# EAGLE design PGTNX06_ioexpander (EAGLE 9.6.0)
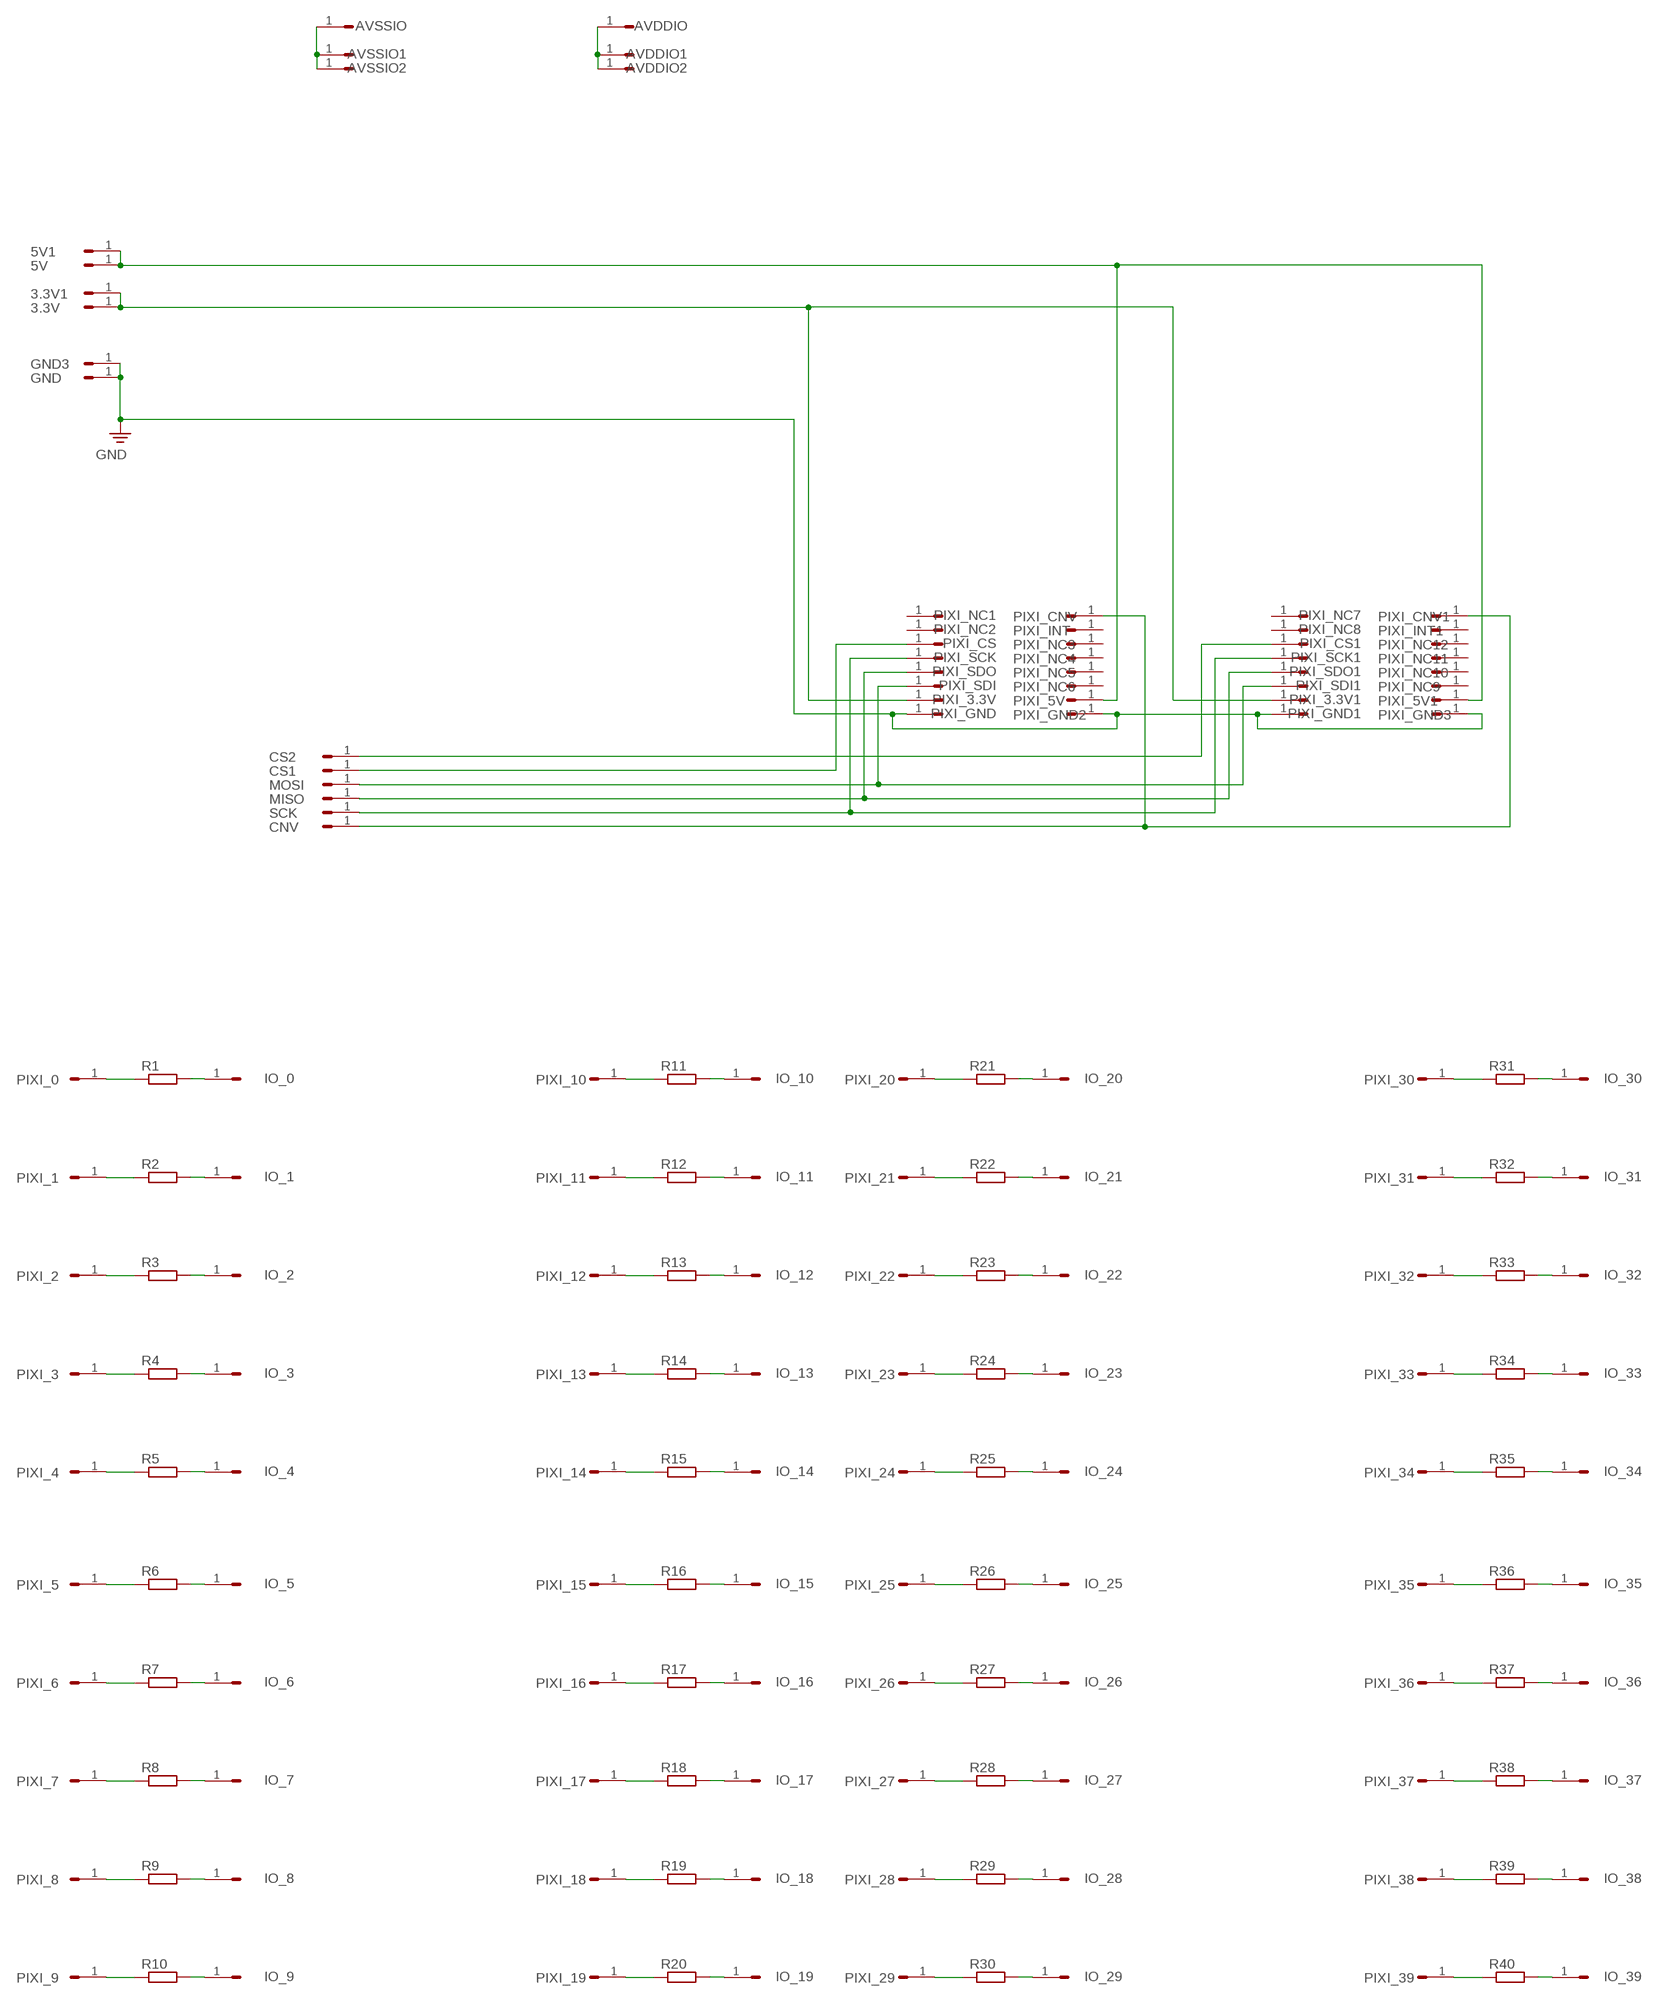
[diagram p0: schematic, sheet 1]

## Parts
3.3V  HEADER/MALE/01  [HEADER/MALE/01]
3.3V1  HEADER/MALE/01  [HEADER/MALE/01]
5V  HEADER/MALE/01  [HEADER/MALE/01]
5V1  HEADER/MALE/01  [HEADER/MALE/01]
AVDDIO  HEADER/MALE/01  [HEADER/MALE/01]
AVDDIO1  HEADER/MALE/01  [HEADER/MALE/01]
AVDDIO2  HEADER/MALE/01  [HEADER/MALE/01]
AVSSIO  HEADER/MALE/01  [HEADER/MALE/01]
AVSSIO1  HEADER/MALE/01  [HEADER/MALE/01]
AVSSIO2  HEADER/MALE/01  [HEADER/MALE/01]
CNV  HEADER/MALE/01  [HEADER/MALE/01]
CS1  HEADER/MALE/01  [HEADER/MALE/01]
CS2  HEADER/MALE/01  [HEADER/MALE/01]
GND  HEADER/MALE/01  [HEADER/MALE/01]
GND3  HEADER/MALE/01  [HEADER/MALE/01]
IO_0  HEADER/MALE/01  [HEADER/MALE/01]
IO_1  HEADER/MALE/01  [HEADER/MALE/01]
IO_2  HEADER/MALE/01  [HEADER/MALE/01]
IO_3  HEADER/MALE/01  [HEADER/MALE/01]
IO_4  HEADER/MALE/01  [HEADER/MALE/01]
IO_5  HEADER/MALE/01  [HEADER/MALE/01]
IO_6  HEADER/MALE/01  [HEADER/MALE/01]
IO_7  HEADER/MALE/01  [HEADER/MALE/01]
IO_8  HEADER/MALE/01  [HEADER/MALE/01]
IO_9  HEADER/MALE/01  [HEADER/MALE/01]
IO_10  HEADER/MALE/01  [HEADER/MALE/01]
IO_11  HEADER/MALE/01  [HEADER/MALE/01]
IO_12  HEADER/MALE/01  [HEADER/MALE/01]
IO_13  HEADER/MALE/01  [HEADER/MALE/01]
IO_14  HEADER/MALE/01  [HEADER/MALE/01]
IO_15  HEADER/MALE/01  [HEADER/MALE/01]
IO_16  HEADER/MALE/01  [HEADER/MALE/01]
IO_17  HEADER/MALE/01  [HEADER/MALE/01]
IO_18  HEADER/MALE/01  [HEADER/MALE/01]
IO_19  HEADER/MALE/01  [HEADER/MALE/01]
IO_20  HEADER/MALE/01  [HEADER/MALE/01]
IO_21  HEADER/MALE/01  [HEADER/MALE/01]
IO_22  HEADER/MALE/01  [HEADER/MALE/01]
IO_23  HEADER/MALE/01  [HEADER/MALE/01]
IO_24  HEADER/MALE/01  [HEADER/MALE/01]
IO_25  HEADER/MALE/01  [HEADER/MALE/01]
IO_26  HEADER/MALE/01  [HEADER/MALE/01]
IO_27  HEADER/MALE/01  [HEADER/MALE/01]
IO_28  HEADER/MALE/01  [HEADER/MALE/01]
IO_29  HEADER/MALE/01  [HEADER/MALE/01]
IO_30  HEADER/MALE/01  [HEADER/MALE/01]
IO_31  HEADER/MALE/01  [HEADER/MALE/01]
IO_32  HEADER/MALE/01  [HEADER/MALE/01]
IO_33  HEADER/MALE/01  [HEADER/MALE/01]
IO_34  HEADER/MALE/01  [HEADER/MALE/01]
IO_35  HEADER/MALE/01  [HEADER/MALE/01]
IO_36  HEADER/MALE/01  [HEADER/MALE/01]
IO_37  HEADER/MALE/01  [HEADER/MALE/01]
IO_38  HEADER/MALE/01  [HEADER/MALE/01]
IO_39  HEADER/MALE/01  [HEADER/MALE/01]
MISO  HEADER/MALE/01  [HEADER/MALE/01]
MOSI  HEADER/MALE/01  [HEADER/MALE/01]
PIXI_0  HEADER/MALE/01  [HEADER/MALE/01]
PIXI_1  HEADER/MALE/01  [HEADER/MALE/01]
PIXI_2  HEADER/MALE/01  [HEADER/MALE/01]
PIXI_3  HEADER/MALE/01  [HEADER/MALE/01]
PIXI_3.3V  HEADER/MALE/01  [HEADER/MALE/01]
PIXI_3.3V1  HEADER/MALE/01  [HEADER/MALE/01]
PIXI_4  HEADER/MALE/01  [HEADER/MALE/01]
PIXI_5  HEADER/MALE/01  [HEADER/MALE/01]
PIXI_5V  HEADER/MALE/01  [HEADER/MALE/01]
PIXI_5V1  HEADER/MALE/01  [HEADER/MALE/01]
PIXI_6  HEADER/MALE/01  [HEADER/MALE/01]
PIXI_7  HEADER/MALE/01  [HEADER/MALE/01]
PIXI_8  HEADER/MALE/01  [HEADER/MALE/01]
PIXI_9  HEADER/MALE/01  [HEADER/MALE/01]
PIXI_10  HEADER/MALE/01  [HEADER/MALE/01]
PIXI_11  HEADER/MALE/01  [HEADER/MALE/01]
PIXI_12  HEADER/MALE/01  [HEADER/MALE/01]
PIXI_13  HEADER/MALE/01  [HEADER/MALE/01]
PIXI_14  HEADER/MALE/01  [HEADER/MALE/01]
PIXI_15  HEADER/MALE/01  [HEADER/MALE/01]
PIXI_16  HEADER/MALE/01  [HEADER/MALE/01]
PIXI_17  HEADER/MALE/01  [HEADER/MALE/01]
PIXI_18  HEADER/MALE/01  [HEADER/MALE/01]
PIXI_19  HEADER/MALE/01  [HEADER/MALE/01]
PIXI_20  HEADER/MALE/01  [HEADER/MALE/01]
PIXI_21  HEADER/MALE/01  [HEADER/MALE/01]
PIXI_22  HEADER/MALE/01  [HEADER/MALE/01]
PIXI_23  HEADER/MALE/01  [HEADER/MALE/01]
PIXI_24  HEADER/MALE/01  [HEADER/MALE/01]
PIXI_25  HEADER/MALE/01  [HEADER/MALE/01]
PIXI_26  HEADER/MALE/01  [HEADER/MALE/01]
PIXI_27  HEADER/MALE/01  [HEADER/MALE/01]
PIXI_28  HEADER/MALE/01  [HEADER/MALE/01]
PIXI_29  HEADER/MALE/01  [HEADER/MALE/01]
PIXI_30  HEADER/MALE/01  [HEADER/MALE/01]
PIXI_31  HEADER/MALE/01  [HEADER/MALE/01]
PIXI_32  HEADER/MALE/01  [HEADER/MALE/01]
PIXI_33  HEADER/MALE/01  [HEADER/MALE/01]
PIXI_34  HEADER/MALE/01  [HEADER/MALE/01]
PIXI_35  HEADER/MALE/01  [HEADER/MALE/01]
PIXI_36  HEADER/MALE/01  [HEADER/MALE/01]
PIXI_37  HEADER/MALE/01  [HEADER/MALE/01]
PIXI_38  HEADER/MALE/01  [HEADER/MALE/01]
PIXI_39  HEADER/MALE/01  [HEADER/MALE/01]
PIXI_CNV  HEADER/MALE/01  [HEADER/MALE/01]
PIXI_CNV1  HEADER/MALE/01  [HEADER/MALE/01]
PIXI_CS  HEADER/MALE/01  [HEADER/MALE/01]
PIXI_CS1  HEADER/MALE/01  [HEADER/MALE/01]
PIXI_GND  HEADER/MALE/01  [HEADER/MALE/01]
PIXI_GND1  HEADER/MALE/01  [HEADER/MALE/01]
PIXI_GND2  HEADER/MALE/01  [HEADER/MALE/01]
PIXI_GND3  HEADER/MALE/01  [HEADER/MALE/01]
PIXI_INT  HEADER/MALE/01  [HEADER/MALE/01]
PIXI_INT1  HEADER/MALE/01  [HEADER/MALE/01]
PIXI_NC1  HEADER/MALE/01  [HEADER/MALE/01]
PIXI_NC2  HEADER/MALE/01  [HEADER/MALE/01]
PIXI_NC3  HEADER/MALE/01  [HEADER/MALE/01]
PIXI_NC4  HEADER/MALE/01  [HEADER/MALE/01]
PIXI_NC5  HEADER/MALE/01  [HEADER/MALE/01]
PIXI_NC6  HEADER/MALE/01  [HEADER/MALE/01]
PIXI_NC7  HEADER/MALE/01  [HEADER/MALE/01]
PIXI_NC8  HEADER/MALE/01  [HEADER/MALE/01]
PIXI_NC9  HEADER/MALE/01  [HEADER/MALE/01]
PIXI_NC10  HEADER/MALE/01  [HEADER/MALE/01]
PIXI_NC11  HEADER/MALE/01  [HEADER/MALE/01]
PIXI_NC12  HEADER/MALE/01  [HEADER/MALE/01]
PIXI_SCK  HEADER/MALE/01  [HEADER/MALE/01]
PIXI_SCK1  HEADER/MALE/01  [HEADER/MALE/01]
PIXI_SDI  HEADER/MALE/01  [HEADER/MALE/01]
PIXI_SDI1  HEADER/MALE/01  [HEADER/MALE/01]
PIXI_SDO  HEADER/MALE/01  [HEADER/MALE/01]
PIXI_SDO1  HEADER/MALE/01  [HEADER/MALE/01]
R1  RESISTORRESISTOR/UPRIGHT/7.5  [RESISTOR/7.5]
R2  RESISTORRESISTOR/UPRIGHT/7.5  [RESISTOR/7.5]
R3  RESISTORRESISTOR/UPRIGHT/7.5  [RESISTOR/7.5]
R4  RESISTORRESISTOR/UPRIGHT/7.5  [RESISTOR/7.5]
R5  RESISTORRESISTOR/UPRIGHT/7.5  [RESISTOR/7.5]
R6  RESISTORRESISTOR/UPRIGHT/7.5  [RESISTOR/7.5]
R7  RESISTORRESISTOR/UPRIGHT/7.5  [RESISTOR/7.5]
R8  RESISTORRESISTOR/UPRIGHT/7.5  [RESISTOR/7.5]
R9  RESISTORRESISTOR/UPRIGHT/7.5  [RESISTOR/7.5]
R10  RESISTORRESISTOR/UPRIGHT/7.5  [RESISTOR/7.5]
R11  RESISTORRESISTOR/UPRIGHT/7.5  [RESISTOR/7.5]
R12  RESISTORRESISTOR/UPRIGHT/7.5  [RESISTOR/7.5]
R13  RESISTORRESISTOR/UPRIGHT/7.5  [RESISTOR/7.5]
R14  RESISTORRESISTOR/UPRIGHT/7.5  [RESISTOR/7.5]
R15  RESISTORRESISTOR/UPRIGHT/7.5  [RESISTOR/7.5]
R16  RESISTORRESISTOR/UPRIGHT/7.5  [RESISTOR/7.5]
R17  RESISTORRESISTOR/UPRIGHT/7.5  [RESISTOR/7.5]
R18  RESISTORRESISTOR/UPRIGHT/7.5  [RESISTOR/7.5]
R19  RESISTORRESISTOR/UPRIGHT/7.5  [RESISTOR/7.5]
R20  RESISTORRESISTOR/UPRIGHT/7.5  [RESISTOR/7.5]
R21  RESISTORRESISTOR/UPRIGHT/7.5  [RESISTOR/7.5]
R22  RESISTORRESISTOR/UPRIGHT/7.5  [RESISTOR/7.5]
R23  RESISTORRESISTOR/UPRIGHT/7.5  [RESISTOR/7.5]
R24  RESISTORRESISTOR/UPRIGHT/7.5  [RESISTOR/7.5]
R25  RESISTORRESISTOR/UPRIGHT/7.5  [RESISTOR/7.5]
R26  RESISTORRESISTOR/UPRIGHT/7.5  [RESISTOR/7.5]
R27  RESISTORRESISTOR/UPRIGHT/7.5  [RESISTOR/7.5]
R28  RESISTORRESISTOR/UPRIGHT/7.5  [RESISTOR/7.5]
R29  RESISTORRESISTOR/UPRIGHT/7.5  [RESISTOR/7.5]
R30  RESISTORRESISTOR/UPRIGHT/7.5  [RESISTOR/7.5]
R31  RESISTORRESISTOR/UPRIGHT/7.5  [RESISTOR/7.5]
R32  RESISTORRESISTOR/UPRIGHT/7.5  [RESISTOR/7.5]
R33  RESISTORRESISTOR/UPRIGHT/7.5  [RESISTOR/7.5]
R34  RESISTORRESISTOR/UPRIGHT/7.5  [RESISTOR/7.5]
R35  RESISTORRESISTOR/UPRIGHT/7.5  [RESISTOR/7.5]
R36  RESISTORRESISTOR/UPRIGHT/7.5  [RESISTOR/7.5]
R37  RESISTORRESISTOR/UPRIGHT/7.5  [RESISTOR/7.5]
R38  RESISTORRESISTOR/UPRIGHT/7.5  [RESISTOR/7.5]
R39  RESISTORRESISTOR/UPRIGHT/7.5  [RESISTOR/7.5]
R40  RESISTORRESISTOR/UPRIGHT/7.5  [RESISTOR/7.5]
SCK  HEADER/MALE/01  [HEADER/MALE/01]

## Nets
3.3V1: 3.3V1.1 3.3V.1 PIXI_3.3V1.1 PIXI_3.3V.1
5V: 5V1.1 5V.1 PIXI_5V1.1 PIXI_5V.1
GND: GND3.1 GND.1 PIXI_GND1.1 PIXI_GND2.1 PIXI_GND3.1 PIXI_GND.1
N$1: PIXI_20.1 R21.1
N$2: CS2.1 PIXI_CS1.1
N$3: IO_20.1 R21.2
N$4: PIXI_21.1 R22.1
N$5: IO_21.1 R22.2
N$6: MISO.1 PIXI_SDO1.1 PIXI_SDO.1
N$7: PIXI_22.1 R23.1
N$8: CS1.1 PIXI_CS.1
N$9: IO_22.1 R23.2
N$10: PIXI_23.1 R24.1
N$11: IO_23.1 R24.2
N$12: PIXI_24.1 R25.1
N$13: IO_24.1 R25.2
N$14: PIXI_25.1 R26.1
N$15: IO_25.1 R26.2
N$16: PIXI_26.1 R27.1
N$17: IO_26.1 R27.2
N$18: PIXI_27.1 R28.1
N$19: IO_27.1 R28.2
N$20: PIXI_28.1 R29.1
N$21: IO_28.1 R29.2
N$22: PIXI_29.1 R30.1
N$23: PIXI_0.1 R1.1
N$24: IO_0.1 R1.2
N$25: PIXI_1.1 R2.1
N$26: IO_29.1 R30.2
N$27: IO_1.1 R2.2
N$28: CNV.1 PIXI_CNV1.1 PIXI_CNV.1
N$29: MOSI.1 PIXI_SDI1.1 PIXI_SDI.1
N$30: PIXI_2.1 R3.1
N$31: PIXI_SCK1.1 PIXI_SCK.1 SCK.1
N$32: PIXI_30.1 R31.1
N$33: IO_2.1 R3.2
N$34: PIXI_3.1 R4.1
N$35: IO_3.1 R4.2
N$36: PIXI_4.1 R5.1
N$37: IO_4.1 R5.2
N$38: PIXI_5.1 R6.1
N$39: IO_5.1 R6.2
N$40: PIXI_6.1 R7.1
N$41: IO_6.1 R7.2
N$42: PIXI_7.1 R8.1
N$43: IO_7.1 R8.2
N$44: PIXI_8.1 R9.1
N$45: IO_8.1 R9.2
N$46: PIXI_9.1 R10.1
N$47: IO_9.1 R10.2
N$48: PIXI_10.1 R11.1
N$49: IO_10.1 R11.2
N$50: PIXI_11.1 R12.1
N$51: IO_11.1 R12.2
N$52: PIXI_12.1 R13.1
N$53: IO_12.1 R13.2
N$54: PIXI_13.1 R14.1
N$55: IO_13.1 R14.2
N$56: PIXI_14.1 R15.1
N$57: IO_14.1 R15.2
N$58: PIXI_15.1 R16.1
N$59: IO_15.1 R16.2
N$60: PIXI_16.1 R17.1
N$61: IO_16.1 R17.2
N$62: PIXI_17.1 R18.1
N$63: IO_17.1 R18.2
N$64: PIXI_18.1 R19.1
N$65: IO_18.1 R19.2
N$66: AVDDIO1.1 AVDDIO2.1 AVDDIO.1
N$67: AVSSIO1.1 AVSSIO2.1 AVSSIO.1
N$68: PIXI_19.1 R20.1
N$69: IO_19.1 R20.2
N$70: IO_30.1 R31.2
N$71: PIXI_31.1 R32.1
N$72: IO_31.1 R32.2
N$73: PIXI_32.1 R33.1
N$74: IO_32.1 R33.2
N$75: PIXI_33.1 R34.1
N$76: IO_33.1 R34.2
N$77: PIXI_34.1 R35.1
N$78: IO_34.1 R35.2
N$79: PIXI_35.1 R36.1
N$80: IO_35.1 R36.2
N$81: PIXI_36.1 R37.1
N$82: IO_36.1 R37.2
N$83: PIXI_37.1 R38.1
N$84: IO_37.1 R38.2
N$85: PIXI_38.1 R39.1
N$86: IO_38.1 R39.2
N$87: PIXI_39.1 R40.1
N$88: IO_39.1 R40.2
Unconnected: PIXI_INT1.1 PIXI_INT.1 PIXI_NC1.1 PIXI_NC2.1 PIXI_NC3.1 PIXI_NC4.1 PIXI_NC5.1 PIXI_NC6.1 PIXI_NC7.1 PIXI_NC8.1 PIXI_NC9.1 PIXI_NC10.1 PIXI_NC11.1 PIXI_NC12.1

## Library data of the parts
3.3V 3.3V1 5V 5V1 AVDDIO AVDDIO1 AVDDIO2 AVSSIO AVSSIO1 AVSSIO2 CNV CS1 CS2 GND GND3 IO_0 IO_1-IO_39 MISO MOSI PIXI_0 PIXI_1-PIXI_3 PIXI_3.3V PIXI_3.3V1 PIXI_4 PIXI_5 PIXI_5V PIXI_5V1 PIXI_6-PIXI_39 PIXI_CNV PIXI_CNV1 PIXI_CS PIXI_CS1 PIXI_GND PIXI_GND1-PIXI_GND3 PIXI_INT PIXI_INT1 PIXI_NC1-PIXI_NC12 PIXI_SCK PIXI_SCK1 PIXI_SDI PIXI_SDI1 PIXI_SDO PIXI_SDO1 SCK = connectors:HEADER/MALE/01; SPICEPREFIX: X
R1-R40 = resistors:RESISTOR: RESISTOR, European symbol

## Board
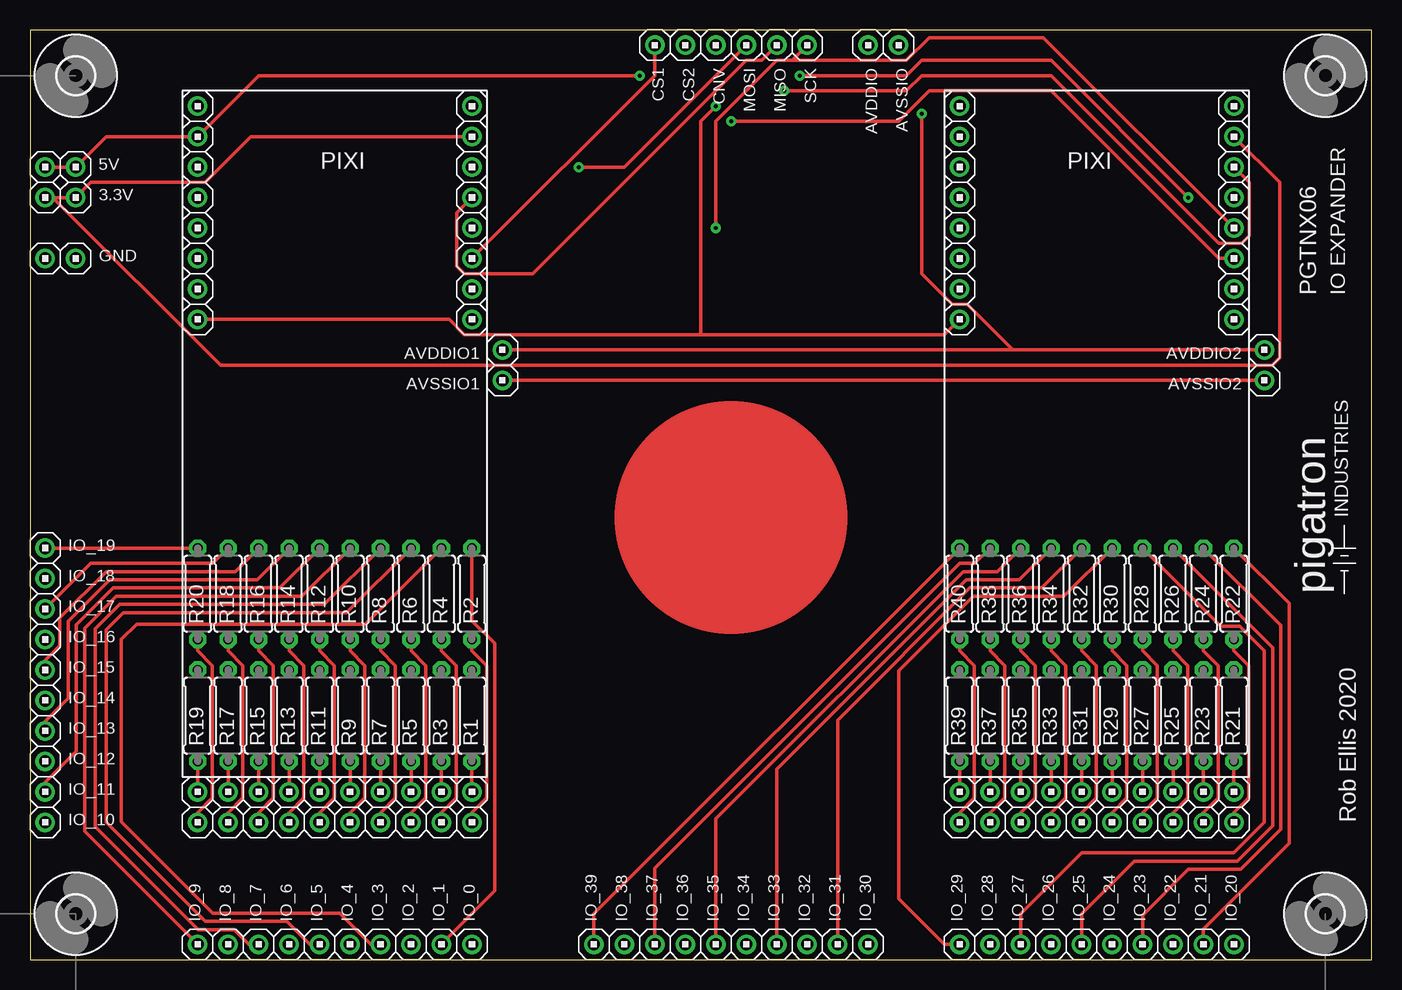
[diagram p1: board, top side]
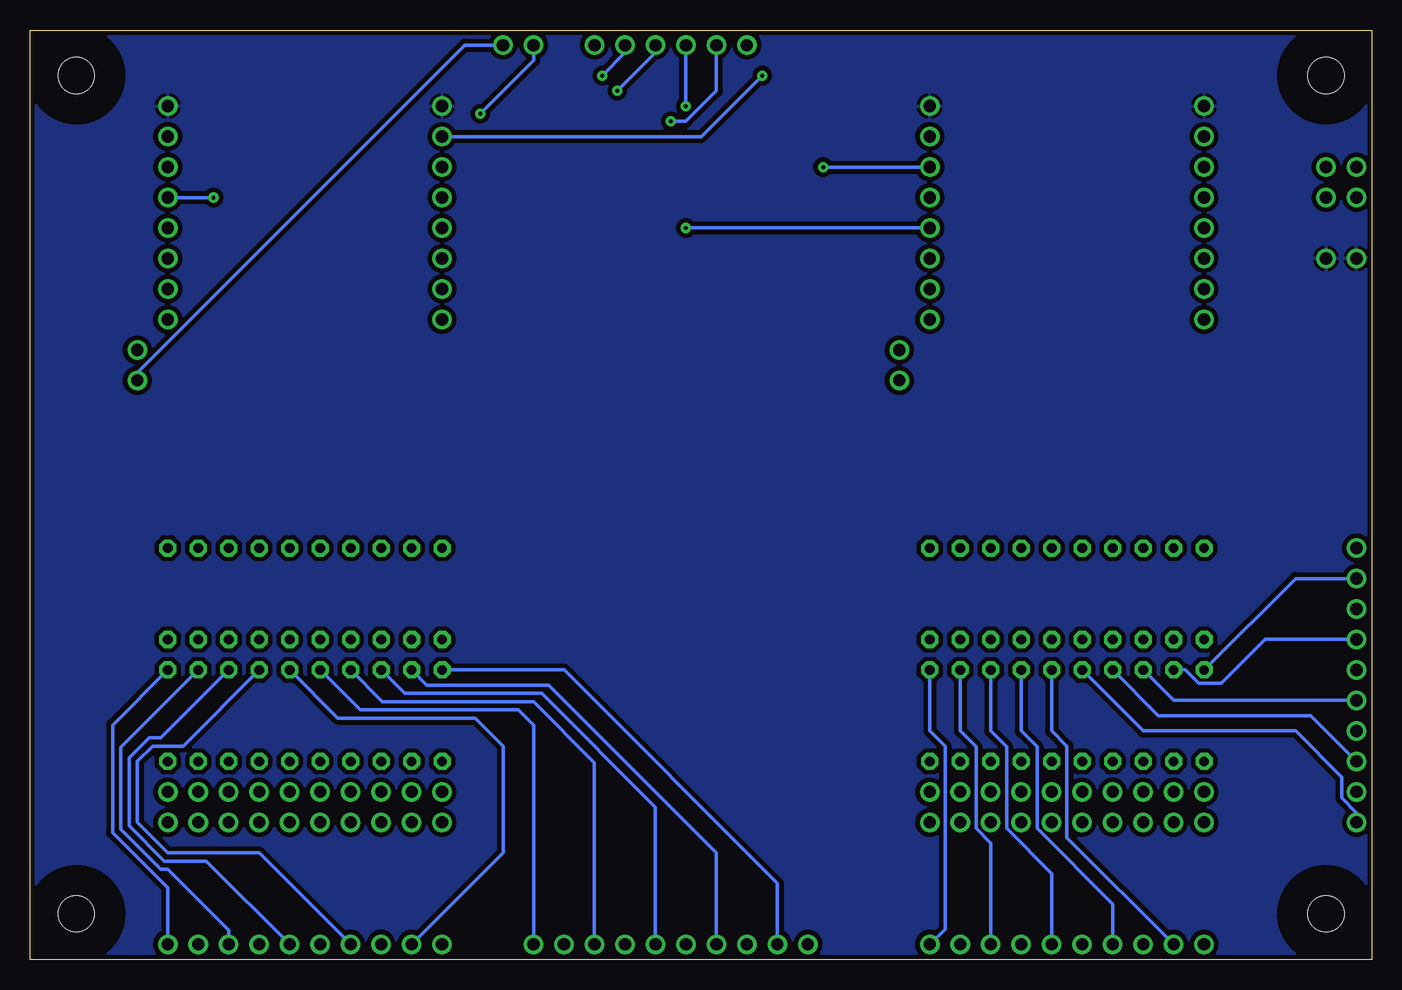
[diagram p2: board, bottom side, seen from below]

Size 111.81 x 77.46 mm. Coordinates in mm from the lower left corner, seen from the top.
Outline: 0,0 111.81,0 111.81,77.46 0,77.46 0,0
Copper layers (1*16): Top 0.0356mm / dielectric 1.5011mm / Bottom 0.0356mm
Design rules "pigatron": minimum track width 12mil, minimum drill 13mil, track to track 15mil, track to pad 10mil, pad to pad 10mil, via to via 10mil, smd to smd 6mil, copper to edge 15mil, drill to drill 10mil, minimum pad ring 12mil, minimum via ring 10mil, stop-mask expansion 4mil, vias tented up to drill 0mil, thermal gap 10mil

### Footprints (pad centres in the part's own frame; a part is rotated, then mirrored left to right if it is on the bottom)
HEADER/MALE/01 = drill 1.016: 1 0,0
RESISTOR/7.5 = drill 0.813 octagon: 1 -3.81,0; 2 3.81,0
STANDOFF/3.0 = hole 3: 0,0

### Placement (x,y rotation side)
3.3V  3.81,63.5 0 top
3.3V1  1.27,63.5 0 top
5V  3.81,66.04 0 top
5V1  1.27,66.04 0 top
AVDDIO  69.85,76.2 270 top
AVDDIO1  39.37,50.8 180 top
AVDDIO2  102.87,50.8 180 top
AVSSIO  72.39,76.2 270 top
AVSSIO1  39.37,48.26 180 top
AVSSIO2  102.87,48.26 180 top
CNV  57.15,76.2 270 top
CS1  52.07,76.2 270 top
CS2  54.61,76.2 270 top
GND  3.81,58.42 0 top
GND3  1.27,58.42 0 top
IO_0  36.83,1.27 90 top
IO_1  34.29,1.27 90 top
IO_2  31.75,1.27 90 top
IO_3  29.21,1.27 90 top
IO_4  26.67,1.27 90 top
IO_5  24.13,1.27 90 top
IO_6  21.59,1.27 90 top
IO_7  19.05,1.27 90 top
IO_8  16.51,1.27 90 top
IO_9  13.97,1.27 90 top
IO_10  1.27,11.43 0 top
IO_11  1.27,13.97 0 top
IO_12  1.27,16.51 0 top
IO_13  1.27,19.05 0 top
IO_14  1.27,21.59 0 top
IO_15  1.27,24.13 0 top
IO_16  1.27,26.67 0 top
IO_17  1.27,29.21 0 top
IO_18  1.27,31.75 0 top
IO_19  1.27,34.29 0 top
IO_20  100.33,1.27 90 top
IO_21  97.79,1.27 90 top
IO_22  95.25,1.27 90 top
IO_23  92.71,1.27 90 top
IO_24  90.17,1.27 90 top
IO_25  87.63,1.27 90 top
IO_26  85.09,1.27 90 top
IO_27  82.55,1.27 90 top
IO_28  80.01,1.27 90 top
IO_29  77.47,1.27 90 top
IO_30  69.85,1.27 90 top
IO_31  67.31,1.27 90 top
IO_32  64.77,1.27 90 top
IO_33  62.23,1.27 90 top
IO_34  59.69,1.27 90 top
IO_35  57.15,1.27 90 top
IO_36  54.61,1.27 90 top
IO_37  52.07,1.27 90 top
IO_38  49.53,1.27 90 top
IO_39  46.99,1.27 90 top
MISO  62.23,76.2 270 top
MOSI  59.69,76.2 270 top
PIXI_0  36.83,13.97 90 top
PIXI_1  36.83,11.43 270 top
PIXI_2  34.29,13.97 90 top
PIXI_3  34.29,11.43 270 top
PIXI_3.3V  36.83,68.58 180 top
PIXI_3.3V1  100.33,68.58 0 top
PIXI_4  31.75,13.97 90 top
PIXI_5  31.75,11.43 270 top
PIXI_5V  13.97,68.58 0 top
PIXI_5V1  77.47,68.58 0 top
PIXI_6  29.21,13.97 90 top
PIXI_7  29.21,11.43 270 top
PIXI_8  26.67,13.97 90 top
PIXI_9  26.67,11.43 270 top
PIXI_10  24.13,13.97 90 top
PIXI_11  24.13,11.43 270 top
PIXI_12  21.59,13.97 90 top
PIXI_13  21.59,11.43 270 top
PIXI_14  19.05,13.97 90 top
PIXI_15  19.05,11.43 270 top
PIXI_16  16.51,13.97 90 top
PIXI_17  16.51,11.43 270 top
PIXI_18  13.97,13.97 90 top
PIXI_19  13.97,11.43 270 top
PIXI_20  100.33,13.97 0 top
PIXI_21  100.33,11.43 0 top
PIXI_22  97.79,13.97 0 top
PIXI_23  97.79,11.43 0 top
PIXI_24  95.25,13.97 0 top
PIXI_25  95.25,11.43 0 top
PIXI_26  92.71,13.97 0 top
PIXI_27  92.71,11.43 0 top
PIXI_28  90.17,13.97 0 top
PIXI_29  90.17,11.43 0 top
PIXI_30  87.63,13.97 0 top
PIXI_31  87.63,11.43 0 top
PIXI_32  85.09,13.97 0 top
PIXI_33  85.09,11.43 0 top
PIXI_34  82.55,13.97 0 top
PIXI_35  82.55,11.43 0 top
PIXI_36  80.01,13.97 0 top
PIXI_37  80.01,11.43 0 top
PIXI_38  77.47,13.97 0 top
PIXI_39  77.47,11.43 0 top
PIXI_CNV  13.97,53.34 0 top
PIXI_CNV1  77.47,53.34 0 top
PIXI_CS  36.83,58.42 180 top
PIXI_CS1  100.33,58.42 0 top
PIXI_GND  36.83,71.12 180 top
PIXI_GND1  77.47,71.12 0 top
PIXI_GND2  13.97,71.12 0 top
PIXI_GND3  100.33,71.12 0 top
PIXI_INT  13.97,55.88 0 top
PIXI_INT1  77.47,55.88 0 top
PIXI_NC1  36.83,53.34 180 top
PIXI_NC2  36.83,55.88 180 top
PIXI_NC3  13.97,58.42 0 top
PIXI_NC4  13.97,60.96 0 top
PIXI_NC5  13.97,63.5 0 top
PIXI_NC6  13.97,66.04 0 top
PIXI_NC7  77.47,66.04 0 top
PIXI_NC8  77.47,63.5 0 top
PIXI_NC9  100.33,53.34 0 top
PIXI_NC10  77.47,58.42 0 top
PIXI_NC11  100.33,55.88 0 top
PIXI_NC12  77.47,60.96 0 top
PIXI_SCK  36.83,60.96 180 top
PIXI_SCK1  100.33,60.96 0 top
PIXI_SDI  36.83,66.04 180 top
PIXI_SDI1  100.33,66.04 0 top
PIXI_SDO  36.83,63.5 180 top
PIXI_SDO1  100.33,63.5 0 top
R1  36.83,20.32 90 top
R2  36.83,30.48 90 top
R3  34.29,20.32 90 top
R4  34.29,30.48 90 top
R5  31.75,20.32 90 top
R6  31.75,30.48 90 top
R7  29.21,20.32 90 top
R8  29.21,30.48 90 top
R9  26.67,20.32 90 top
R10  26.67,30.48 90 top
R11  24.13,20.32 90 top
R12  24.13,30.48 90 top
R13  21.59,20.32 90 top
R14  21.59,30.48 90 top
R15  19.05,20.32 90 top
R16  19.05,30.48 90 top
R17  16.51,20.32 90 top
R18  16.51,30.48 90 top
R19  13.97,20.32 90 top
R20  13.97,30.48 90 top
R21  100.33,20.32 90 top
R22  100.33,30.48 90 top
R23  97.79,20.32 90 top
R24  97.79,30.48 90 top
R25  95.25,20.32 90 top
R26  95.25,30.48 90 top
R27  92.71,20.32 90 top
R28  92.71,30.48 90 top
R29  90.17,20.32 90 top
R30  90.17,30.48 90 top
R31  87.63,20.32 90 top
R32  87.63,30.48 90 top
R33  85.09,20.32 90 top
R34  85.09,30.48 90 top
R35  82.55,20.32 90 top
R36  82.55,30.48 90 top
R37  80.01,20.32 90 top
R38  80.01,30.48 90 top
R39  77.47,20.32 90 top
R40  77.47,30.48 90 top
SCK  64.77,76.2 270 top
U$2  [STANDOFF/3.0]  3.81,73.66 0 top
U$3  [STANDOFF/3.0]  107.95,73.66 0 top
U$4  [STANDOFF/3.0]  107.95,3.81 0 top
U$5  [PIGATRON-LOGO]  107.95,39.37 90 top
U$6  [PIGATRON-LOGO_TSTOP]  59.18,36.7 0 top
U$7  [STANDOFF/3.0]  3.81,3.81 0 top

### Tracks (layer width: path | path; a pad name or v marks a point on that pad's centre or on a via)
3.3V1
  Top 0.305: 1.91,63.5 3.3V.1 5.08,64.77 14.61,64.77 18.41,68.58 PIXI_3.3V.1 | PIXI_3.3V1.1 104.14,64.77 104.14,50.16 103.5,49.53 15.88,49.53 1.91,63.5 | 1.91,63.5 3.3V1.1
5V  (via drill 0.33)
  Top 0.305: 5V1.1 5V.1 6.35,68.58 PIXI_5V.1 19.05,73.66 v50.8,73.66
  Bottom 0.305: PIXI_5V1.1 55.88,68.58 v50.8,73.66
GND
  pour Bottom: 0,77.47 111.76,77.47 111.76,0 0,0
N$1
  Top 0.305: PIXI_20.1 R21.1
N$2  (via drill 0.33)
  Top 0.305: v58.42,69.85 72.39,69.85 74.93,72.39 85.09,72.39 99.06,58.42 PIXI_CS1.1
  Bottom 0.305: CS2.1 54.61,72.39 57.15,69.85 v58.42,69.85
N$3
  Bottom 0.305: R21.2 104.93,19.53 104.93,10.58 100.33,5.98 IO_20.1
N$4
  Top 0.305: R22.1 100.33,25.71 101.55,24.49 101.55,13.46 100.33,12.25 PIXI_21.1
N$5
  Top 0.305: R22.2 104.93,29.69 104.93,9.68 97.79,2.54 IO_21.1
N$6  (via drill 0.33)
  Top 0.305: PIXI_SDO.1 35.56,62.23 35.56,57.78 36.2,57.15 41.91,57.15 59.69,74.93 60.96,74.93 MISO.1 | v96.52,63.5 85.09,74.93 74.3,74.93 73.03,73.66 v64.14,73.66
  Bottom 0.305: v96.52,63.5 PIXI_SDO1.1 | v64.14,73.66 62.23,75.56 MISO.1
N$7
  Top 0.305: PIXI_22.1 R23.1
N$8
  Top 0.305: PIXI_CS.1 52.07,73.66 CS1.1
N$9
  Bottom 0.305: R23.2 104.24,17.68 104.24,10.86 100.9,7.52 100.33,7.52 95.25,2.44 IO_22.1
N$10
  Top 0.305: R24.1 97.79,25.71 99.01,24.49 99.01,13.46 97.79,12.25 PIXI_23.1
N$11
  Top 0.305: R24.2 104.24,27.84 104.24,10.86 100.9,7.52 96.52,7.52 92.71,3.71 IO_23.1
N$12
  Top 0.305: PIXI_24.1 R25.1
N$13
  Bottom 0.305: R25.2 100.91,18.47 101.88,18.47 103.56,16.79 103.56,11.15 100.61,8.2 97.1,8.2 IO_24.1
N$14
  Top 0.305: R26.1 95.25,25.71 96.47,24.49 96.47,13.46 95.25,12.25 PIXI_25.1
N$15
  Top 0.305: R26.2 101.07,28.47 101.08,28.47 103.56,26 103.56,11.15 100.61,8.2 92.02,8.2 87.63,3.81 IO_25.1
N$16
  Top 0.305: PIXI_26.1 R27.1
N$17
  Bottom 0.305: R27.2 99.06,17.78 101.6,17.78 102.87,16.51 102.87,11.43 100.33,8.89 92.71,8.89 IO_26.1
N$18
  Top 0.305: R28.1 92.71,25.71 93.93,24.49 93.93,13.46 92.71,12.25 PIXI_27.1
N$19
  Top 0.305: R28.2 99.21,27.79 100.79,27.79 102.87,25.71 102.87,11.43 100.33,8.89 87.63,8.89 82.55,3.81 IO_27.1
N$20
  Top 0.305: PIXI_28.1 R29.1
N$21
  Bottom 0.305: R29.2 86.16,20.12 74.73,20.12 72.39,17.78 72.39,8.89 IO_28.1
N$22
  Top 0.305: R30.1 90.17,25.71 91.39,24.49 91.39,13.46 90.17,12.25 PIXI_29.1
N$23
  Top 0.305: PIXI_0.1 R1.1
N$24
  Bottom 0.305: R1.2 36.83,19.05 35.56,17.78 35.56,2.54 IO_0.1
N$25
  Top 0.305: R2.1 36.83,25.71 38.05,24.49 38.05,13.46 36.83,12.25 PIXI_1.1
N$26
  Top 0.305: R30.2 86.16,30.28 78.61,30.28 72.39,24.06 72.39,5.08 76.2,1.27 IO_29.1
N$27
  Top 0.305: R2.2 36.83,28.25 38.73,26.35 38.73,5.71 IO_1.1
N$28  (via drill 0.33)
  Top 0.305: PIXI_CNV.1 34.92,53.34 36.2,52.07 55.88,52.07 | 55.88,52.07 76.2,52.07 PIXI_CNV1.1 | v57.15,71.12 55.88,69.85 55.88,52.07
  Bottom 0.305: v57.15,71.12 CNV.1
N$29  (via drill 0.33)
  Top 0.305: v45.72,66.04 49.53,66.04 MOSI.1 | PIXI_SDI1.1 101.6,64.77 101.6,60.33 100.97,59.69 99.06,59.69 85.09,73.66 74.3,73.66 73.03,72.39 v62.87,72.39
  Bottom 0.305: v45.72,66.04 PIXI_SDI.1 | v62.87,72.39 59.69,75.56 MOSI.1
N$30
  Top 0.305: PIXI_2.1 R3.1
N$31  (via drill 0.33)
  Top 0.305: v57.15,60.96 57.15,69.85 62.23,74.93 63.5,74.93 | SCK.1 63.5,74.93 | PIXI_SCK1.1 84.45,76.83 74.93,76.83 73.03,74.93 63.5,74.93
  Bottom 0.305: v57.15,60.96 PIXI_SCK.1
N$32
  Top 0.305: PIXI_30.1 R31.1
N$33
  Bottom 0.305: R3.2 34.29,19.05 32.97,17.73 32.97,10.93 31.75,9.71 IO_2.1
N$34
  Top 0.305: R4.1 34.29,25.71 35.51,24.49 35.51,13.46 34.29,12.25 PIXI_3.1
N$35
  Top 0.305: R4.2 27.94,27.94 8.89,27.94 7.62,26.67 7.62,11.48 15.24,3.86 25.8,3.86 28.39,1.27 IO_3.1
N$36
  Top 0.305: PIXI_4.1 R5.1
N$37
  Bottom 0.305: R5.2 31.75,19.05 30.43,17.73 30.43,10.93 26.67,7.17 IO_4.1
N$38
  Top 0.305: R6.1 31.75,25.71 32.97,24.49 32.97,13.46 31.75,12.25 PIXI_5.1
N$39
  Top 0.305: R6.2 26.36,28.91 7.77,28.91 6.35,27.48 6.35,11.43 14.61,3.17 21.41,3.17 23.31,1.27 IO_5.1
N$40
  Top 0.305: PIXI_6.1 R7.1
N$41
  Bottom 0.305: R7.2 29.21,19.05 27.89,17.73 27.89,10.93 21.59,4.63 IO_6.1
N$42
  Top 0.305: R8.1 29.21,25.71 30.43,24.49 30.43,13.46 29.21,12.25 PIXI_7.1
N$43
  Top 0.305: R8.2 24.51,29.59 7.49,29.59 5.46,27.56 5.46,11.05 14.02,2.49 17.02,2.49 18.23,1.27 IO_7.1
N$44
  Top 0.305: PIXI_8.1 R9.1
N$45
  Bottom 0.305: R9.2 26.67,19.05 25.4,17.78 25.4,10.16 IO_8.1
N$46
  Top 0.305: PIXI_9.1 26.67,12.25 27.89,13.46 27.89,24.49 26.67,25.71 R10.1
N$47
  Top 0.305: R10.2 22.66,30.28 7.2,30.28 4.55,27.62 4.55,10.69 IO_9.1
N$48
  Top 0.305: PIXI_10.1 R11.1
N$49
  Bottom 0.305: R11.2 19.05,19.05 6.35,19.05 2.49,15.19 2.49,13.46 1.27,12.25 IO_10.1
N$50
  Top 0.305: R12.1 24.13,25.71 25.35,24.49 25.35,13.46 24.13,12.25 PIXI_11.1
N$51
  Top 0.305: R12.2 20.8,30.96 6.92,30.96 3.86,27.91 3.86,17.38 1.27,14.79 IO_11.1
N$52
  Top 0.305: PIXI_12.1 R13.1
N$53
  Bottom 0.305: R13.2 17.78,20.32 5.08,20.32 IO_12.1
N$54
  Top 0.305: R14.1 21.59,25.71 22.81,24.49 22.81,13.46 21.59,12.25 PIXI_13.1
N$55
  Top 0.305: R14.2 18.95,31.65 6.63,31.65 3.17,28.19 3.17,21.77 1.27,19.87 IO_13.1
N$56
  Top 0.305: PIXI_14.1 R15.1
N$57
  Bottom 0.305: R15.2 16.51,21.59 IO_14.1
N$58
  Top 0.305: R16.1 19.05,25.71 20.27,24.49 20.27,13.46 19.05,12.25 PIXI_15.1
N$59
  Top 0.305: R16.2 17.09,32.33 6.35,32.33 2.49,28.47 2.49,26.16 1.27,24.95 IO_15.1
N$60
  Top 0.305: PIXI_16.1 R17.1
N$61
  Bottom 0.305: R17.2 15.55,24.13 14.43,23.01 12.55,23.01 8.89,26.67 IO_16.1
N$62
  Top 0.305: R18.1 16.51,25.71 17.73,24.49 17.73,13.46 16.51,12.25 PIXI_17.1
N$63
  Top 0.305: R18.2 15.24,33.02 5.08,33.02 IO_17.1
N$64
  Top 0.305: PIXI_18.1 R19.1
N$65
  Bottom 0.305: R19.2 6.35,31.75 IO_18.1
N$66  (via drill 0.33)
  Top 0.305: AVDDIO2.1 81.92,50.8 | 81.92,50.8 AVDDIO1.1 | v74.3,70.48 74.3,57.15 76.83,54.61 78.11,54.61 81.92,50.8
  Bottom 0.305: AVDDIO.1 69.85,74.93 v74.3,70.48
N$67
  Top 0.305: AVSSIO2.1 AVSSIO1.1
  Bottom 0.305: AVSSIO.1 75.56,76.2 102.87,48.9 AVSSIO2.1
N$68
  Top 0.305: R20.1 13.97,25.71 15.19,24.49 15.19,13.46 13.97,12.25 PIXI_19.1
N$69
  Top 0.305: R20.2 IO_19.1
N$70
  Bottom 0.305: R31.2 84.3,20.8 71.12,20.8 69.85,19.53 IO_30.1
N$71
  Top 0.305: R32.1 87.63,25.71 88.85,24.49 88.85,13.46 87.63,12.25 PIXI_31.1
N$72
  Top 0.305: R32.2 84.3,30.96 78.32,30.96 67.31,19.95 IO_31.1
N$73
  Top 0.305: PIXI_32.1 R33.1
N$74
  Bottom 0.305: R33.2 82.45,21.49 69.85,21.49 64.77,16.41 IO_32.1
N$75
  Top 0.305: R34.1 85.09,25.71 86.31,24.49 86.31,13.46 85.09,12.25 PIXI_33.1
N$76
  Top 0.305: R34.2 82.45,31.65 78.04,31.65 62.23,15.84 IO_33.1
N$77
  Top 0.305: PIXI_34.1 R35.1
N$78
  Bottom 0.305: R35.2 80.59,22.17 69.16,22.17 59.69,12.7 IO_34.1
N$79
  Top 0.305: R36.1 82.55,25.71 83.77,24.49 83.77,13.46 82.55,12.25 PIXI_35.1
N$80
  Top 0.305: R36.2 80.59,32.33 77.75,32.33 57.15,11.73 IO_35.1
N$81
  Top 0.305: PIXI_36.1 R37.1
N$82
  Bottom 0.305: R37.2 78.74,22.86 68.58,22.86 54.61,8.89 IO_36.1
N$83
  Top 0.305: R38.1 80.01,25.71 81.23,24.49 81.23,13.46 80.01,12.25 PIXI_37.1
N$84
  Top 0.305: R38.2 78.74,33.02 77.47,33.02 52.07,7.62 IO_37.1
N$85
  Top 0.305: PIXI_38.1 R39.1
N$86
  Bottom 0.305: R39.2 67.31,24.13 49.53,6.35 IO_38.1
N$87
  Top 0.305: R40.1 77.47,25.71 78.69,24.49 78.69,13.46 77.47,12.25 PIXI_39.1
N$88
  Top 0.305: R40.2 46.99,3.81 IO_39.1
(copper drawn outside any net)
  shapes: Top circle x1

### Text on the board
tNames: PIXI | PIXI | PGTNX06 | IO EXPANDER | Rob Ellis 2020